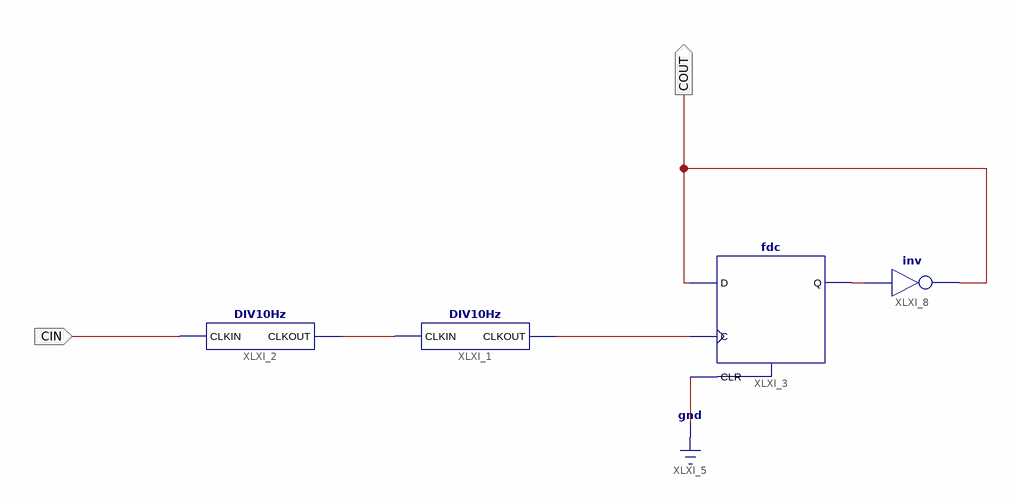
[diagram p0: schematic sheet 1]
// Xilinx ISE schematic DIV200Hz.sch (spartan6) as structural Verilog: 4 symbols, 2 ports
module DIV200Hz (
  input  CIN,
  output COUT
);

  wire XLXN_1, XLXN_5, XLXN_11;

  DIV10Hz XLXI_1 (.CLKIN(XLXN_5), .CLKOUT(XLXN_1));
  DIV10Hz XLXI_2 (.CLKIN(CIN), .CLKOUT(XLXN_5));
  fdc XLXI_3 (.C(XLXN_1), .CLR(1'b0), .D(COUT), .Q(XLXN_11));
  not XLXI_8 (COUT, XLXN_11);
endmodule
